# Altium schematic sheet Buck.SchDoc: Buck Converter
size A4; Author: Adam Mizerkiewicz; CompanyName: Saule S.A.; DrawnBy: Adam Mizerkiewicz; Organization: Saule S.A.; Address1: Ul. Duńska 11; Address2: 54-427 Wrocław; DocumentNumber: 6; SheetNumber: 6; SheetTotal: 42
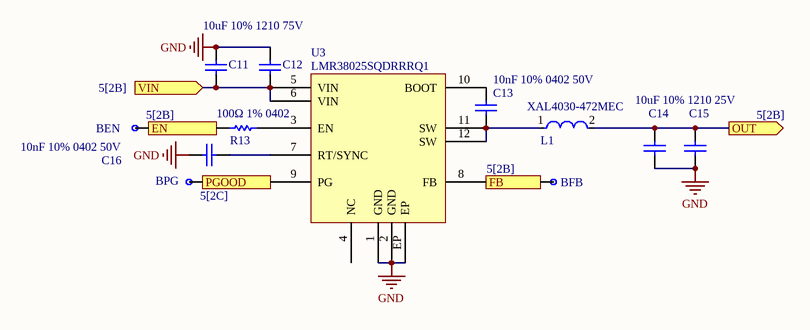
[diagram p0: Buck.SchDoc]

## Parts
BEN  Testpoint  [Testpoint-Footprint-1]  (value not drawn)  (no BOM)
BFB  Testpoint  [Testpoint-Footprint-1]  (value not drawn)  (no BOM)
BPG  Testpoint  [Testpoint-Footprint-1]  (value not drawn)  (no BOM)
C11  10uF 10% 1210 75V  [1210N]
C12  10nF 10% 0402 75V  [0402N]  (value not drawn)
C13  10nF 10% 0402 50V  [0402N]
C14  10uF 10% 1210 25V  [1210N]
C15  10uF 10% 1210 25V  [1210N]  (value not drawn)
C16  10nF 10% 0402 50V  [0402N]
L1  XAL4030-472MEC  [FP-XAL4030-472MEC-MFG]
R13  100Ω 1% 0402  [0402N]
U3  LMR38025SQDRRRQ1  [LMR38025SQDRRRQ1-Footprint-1]

## Ports
EN (in, see 5[2B]), FB (in, see 5[2B]), OUT (out, see 5[2B]), PGOOD (out, see 5[2C]), VIN (in, see 5[2B])

## Nets
GND: C11.1 C12.1 C14.1 C15.1 C16.2 U3.1(GND) U3.2(GND) U3.EP
EN: BEN.1 R13.2 ; port EN
FB: BFB.1 U3.8(FB) ; port FB
OUT: C14.2 C15.2 L1.2 ; port OUT
PGOOD: BPG.1 U3.9(PG) ; port PGOOD
VIN: C11.2 C12.2 U3.5(VIN) U3.6(VIN) ; port VIN
NetC13_1: C13.1 L1.1 U3.11(SW) U3.12(SW)
NetC13_2: C13.2 U3.10(BOOT)
NetC16_1: C16.1 U3.7(RT/SYNC)
NetR13_1: R13.1 U3.3(EN)

Not connected (* = marked no-connect by the designer): U3 4(NC)

## Notes on the sheet
- Title
- Size:
- Date:
- A4
- Number:
- Time:
- Revision:
- Sheet
- of
- File:

## Library data of the parts
BEN BFB BPG = CMP-003-000002-1
C11 = C1210: Capacitance: 10u; Tolerance: 10; Voltage: 75; Footprint: 1210
C12 = C0402: Capacitance: 10n; Tolerance: 10; Voltage: 75; Footprint: 0402
C13 C16 = C0402: Capacitance: 10n; Tolerance: 10; Voltage: 50; Footprint: 0402
C14 C15 = C1210: Capacitance: 10u; Tolerance: 10; Voltage: 25; Footprint: 1210
L1 = CMP-11268-000082-1: Power Inductor (SMD), 4.7 µH, 5.1 A, Shielded, 4.5 A, XAL40xx Series, 4mm x 4mm x 3.1mm; Tolerance: 20%; DC Resistance (DCR): 44.1mR; Inductance: 4.7uH; Saturation Current: 4.5A; Max DC Current: 5.1A; Self Resonant Frequency: 36MHz; Test Frequency: 100kHz; Core Material: Composite; REACH SVHC: No SVHC; Height: 3.1mm; Package Quantity: 500; Width: 4.3mm; Mount: Surface Mount; RoHS Compliant: Yes; Case/Package: SMD/SMT; Length: 4.3mm; Packaging: Tape and Reel; Max Operating Temperature: 125°C; Min Operating Temperature: -40°C; Series: XAL4030; Termination: SMD/SMT; Inductance Tolerance: 20%; Shielding: Shielded; RMS Current (Irms): 5.1A; Lead Free: Contains Lead
R13 = R0402: Resistance: 100; Tolerance: 1; Footprint: 0402
U3 = CMP-019-00065-1: Automotive grade 80V input 2.5A synchronous step-down (buck) DC/DC converter with spread spectrum 12-WSON -40 to 150